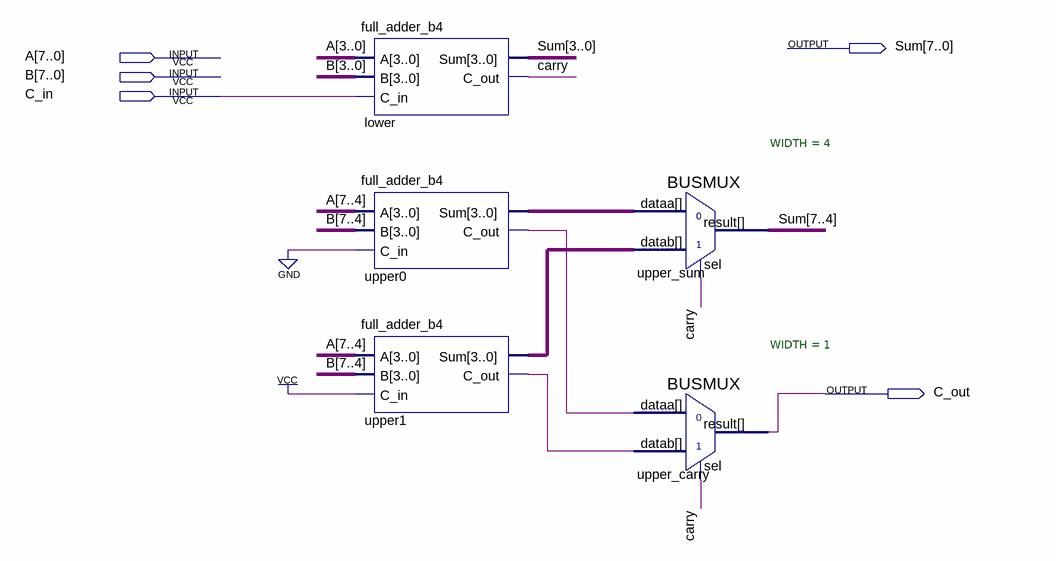
[diagram p0: schematic sheet]
// Quartus schematic full_adder_b8.bdf as structural Verilog: 5 symbols, 5 pins
module full_adder_b8 (
  input  [7:0] A,
  input  [7:0] B,
  input  C_in,
  output [7:0] Sum,
  output C_out
);

  wire carry, upper0_c_out, upper1_c_out;
  wire [3:0] upper0_sum, upper1_sum;

  full_adder_b4 lower (.A(A[3:0]), .B(B[3:0]), .C_in(C_in), .Sum(Sum[3:0]), .C_out(carry));
  full_adder_b4 upper0 (.A(A[7:4]), .B(B[7:4]), .C_in(1'b0), .Sum(upper0_sum), .C_out(upper0_c_out));
  full_adder_b4 upper1 (.A(A[7:4]), .B(B[7:4]), .C_in(1'b1), .Sum(upper1_sum), .C_out(upper1_c_out));
  BUSMUX #(.WIDTH(4)) upper_sum (.datab(upper1_sum), .sel(carry), .dataa(upper0_sum), .result(Sum[7:4]));
  BUSMUX #(.WIDTH(1)) upper_carry (.datab(upper1_c_out), .sel(carry), .dataa(upper0_c_out), .result(C_out));
endmodule
